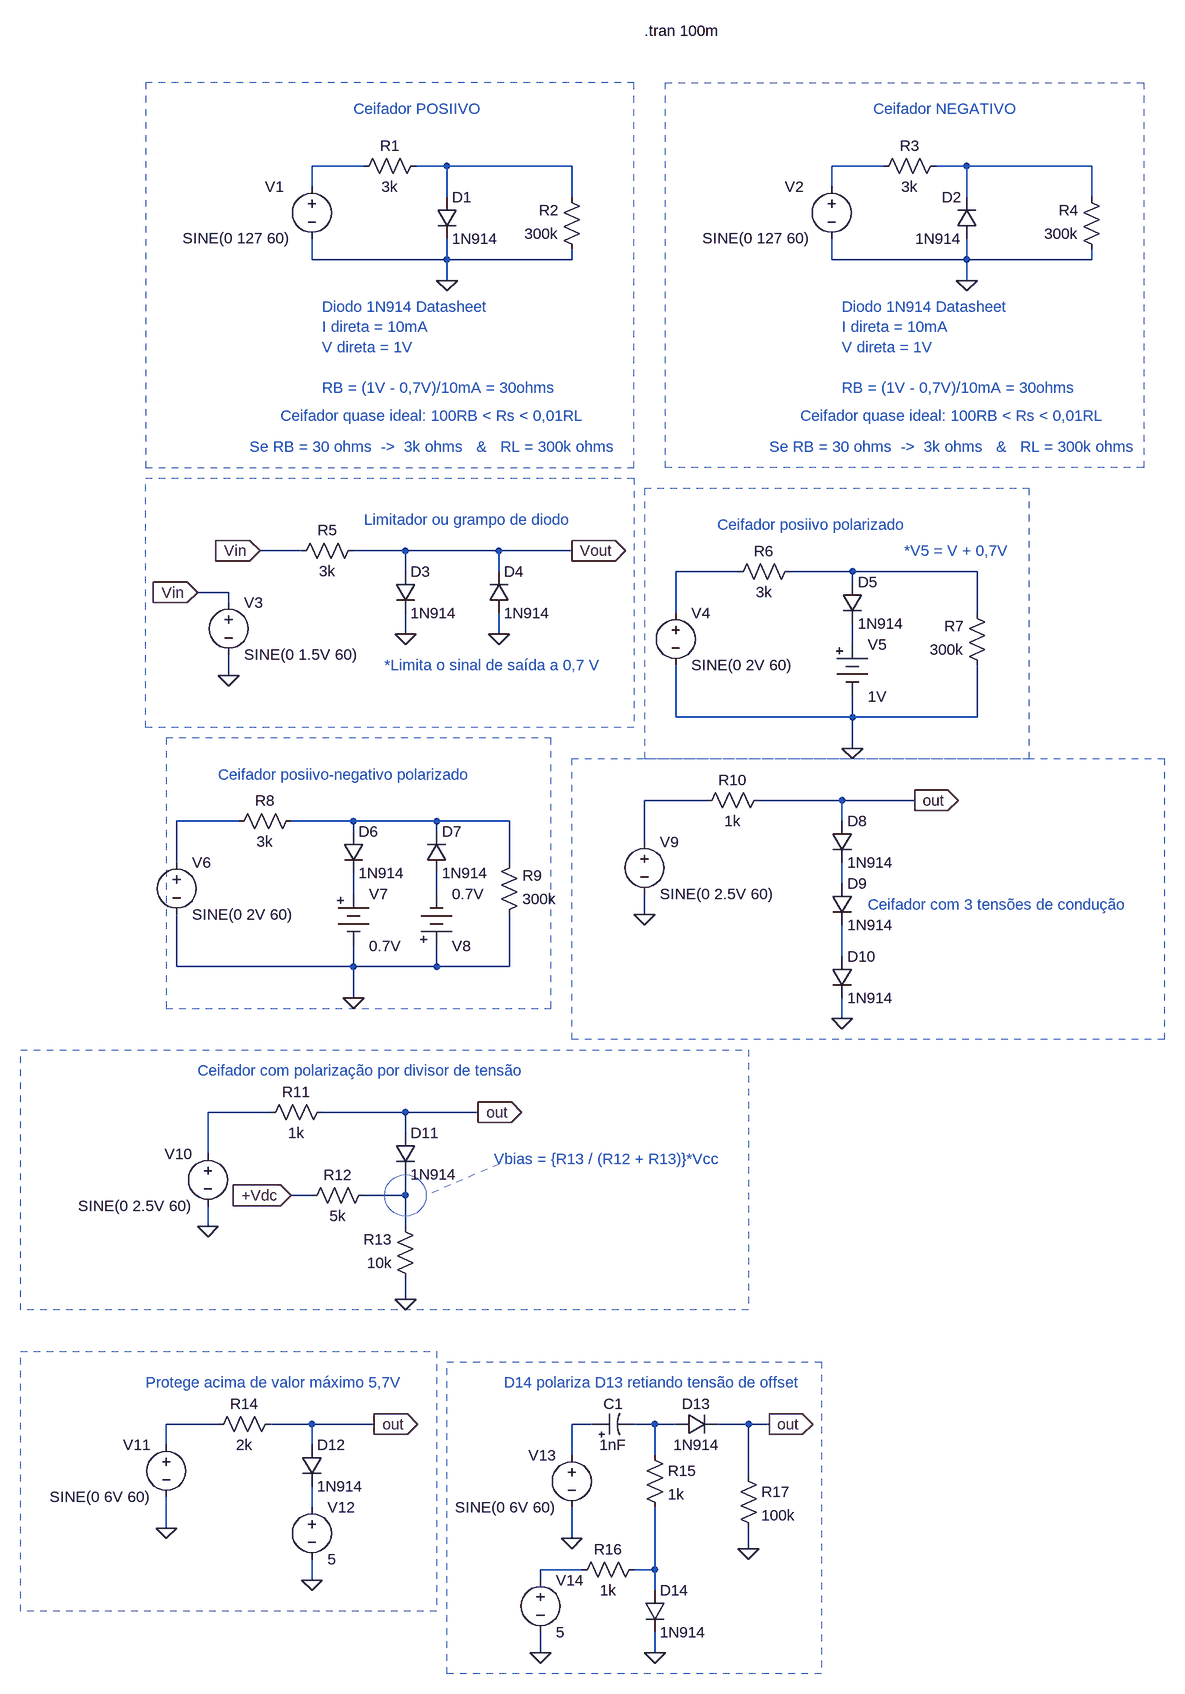
[diagram p0: schematic Circuitos ceifadores com diodos.asc]
Circuitos ceifadores com diodos.asc, the LTspice schematic file:
Version 4.1
SHEET 1 1296 2276
WIRE 16 -48 -64 -48
WIRE 144 -48 96 -48
WIRE 336 -48 144 -48
WIRE 816 -48 736 -48
WIRE 944 -48 896 -48
WIRE 1136 -48 944 -48
WIRE -64 -16 -64 -48
WIRE 736 -16 736 -48
WIRE 144 0 144 -48
WIRE 336 0 336 -48
WIRE 944 0 944 -48
WIRE 1136 0 1136 -48
WIRE -64 96 -64 64
WIRE 144 96 144 64
WIRE 144 96 -64 96
WIRE 336 96 336 80
WIRE 336 96 144 96
WIRE 736 96 736 64
WIRE 944 96 944 64
WIRE 944 96 736 96
WIRE 1136 96 1136 80
WIRE 1136 96 944 96
WIRE 144 128 144 96
WIRE 944 128 944 96
WIRE -80 544 -144 544
WIRE 80 544 0 544
WIRE 224 544 80 544
WIRE 336 544 224 544
WIRE 80 576 80 544
WIRE 224 576 224 544
WIRE 592 576 496 576
WIRE 768 576 672 576
WIRE 960 576 768 576
WIRE 768 592 768 576
WIRE -192 608 -240 608
WIRE -192 624 -192 608
WIRE 496 640 496 576
WIRE 960 640 960 576
WIRE 80 672 80 640
WIRE 224 672 224 640
WIRE 768 688 768 656
WIRE -192 736 -192 704
WIRE 496 800 496 720
WIRE 768 800 768 768
WIRE 768 800 496 800
WIRE 960 800 960 720
WIRE 960 800 768 800
WIRE 768 848 768 800
WIRE 544 928 448 928
WIRE 752 928 624 928
WIRE 864 928 752 928
WIRE -176 960 -272 960
WIRE 0 960 -96 960
WIRE 128 960 0 960
WIRE 240 960 128 960
WIRE 752 960 752 928
WIRE 0 976 0 960
WIRE 128 976 128 960
WIRE 448 992 448 928
WIRE -272 1024 -272 960
WIRE 240 1024 240 960
WIRE 752 1056 752 1024
WIRE 0 1072 0 1040
WIRE 128 1072 128 1040
WIRE 448 1104 448 1072
WIRE 752 1168 752 1120
WIRE -272 1184 -272 1104
WIRE 0 1184 0 1152
WIRE 0 1184 -272 1184
WIRE 128 1184 128 1152
WIRE 128 1184 0 1184
WIRE 240 1184 240 1104
WIRE 240 1184 128 1184
WIRE 0 1232 0 1184
WIRE 752 1264 752 1232
WIRE -128 1408 -224 1408
WIRE 80 1408 -48 1408
WIRE 192 1408 80 1408
WIRE 80 1440 80 1408
WIRE -224 1472 -224 1408
WIRE -64 1536 -96 1536
WIRE 80 1536 80 1504
WIRE 80 1536 16 1536
WIRE -224 1584 -224 1552
WIRE 80 1584 80 1536
WIRE 80 1696 80 1664
WIRE -208 1888 -288 1888
WIRE -64 1888 -128 1888
WIRE 32 1888 -64 1888
WIRE 368 1888 336 1888
WIRE 464 1888 432 1888
WIRE 496 1888 464 1888
WIRE 608 1888 560 1888
WIRE 640 1888 608 1888
WIRE -288 1920 -288 1888
WIRE -64 1920 -64 1888
WIRE 336 1936 336 1888
WIRE 464 1936 464 1888
WIRE 608 1968 608 1888
WIRE -64 2016 -64 1984
WIRE -288 2048 -288 2000
WIRE 336 2064 336 2016
WIRE 608 2080 608 2048
WIRE 352 2112 288 2112
WIRE 464 2112 464 2016
WIRE 464 2112 432 2112
WIRE -64 2128 -64 2096
WIRE 288 2128 288 2112
WIRE 464 2144 464 2112
WIRE 288 2240 288 2208
WIRE 464 2240 464 2208
FLAG 144 128 0
FLAG 944 128 0
FLAG -144 544 Vin
IOPIN -144 544 In
FLAG 80 672 0
FLAG 224 672 0
FLAG 336 544 Vout
IOPIN 336 544 Out
FLAG -240 608 Vin
IOPIN -240 608 In
FLAG -192 736 0
FLAG 768 848 0
FLAG 0 1232 0
FLAG 448 1104 0
FLAG 752 1264 0
FLAG 864 928 out
IOPIN 864 928 Out
FLAG -224 1584 0
FLAG 192 1408 out
IOPIN 192 1408 Out
FLAG 80 1696 0
FLAG -96 1536 +Vdc
IOPIN -96 1536 In
FLAG 32 1888 out
IOPIN 32 1888 Out
FLAG -64 2128 0
FLAG -288 2048 0
FLAG 336 2064 0
FLAG 464 2240 0
FLAG 608 2080 0
FLAG 640 1888 out
IOPIN 640 1888 Out
FLAG 288 2240 0
SYMBOL diode 128 0 R0
SYMATTR InstName D1
SYMATTR Value 1N914
SYMBOL res 112 -64 R90
WINDOW 0 0 56 VBottom 2
WINDOW 3 32 56 VTop 2
SYMATTR InstName R1
SYMATTR Value 3k
SYMBOL res 352 96 R180
WINDOW 0 36 76 Left 2
WINDOW 3 36 40 Left 2
SYMATTR InstName R2
SYMATTR Value 300k
SYMBOL voltage -64 -32 R0
WINDOW 0 -72 16 Left 2
WINDOW 3 -199 95 Left 2
WINDOW 123 0 0 Left 0
WINDOW 39 0 0 Left 0
SYMATTR InstName V1
SYMATTR Value SINE(0 127 60)
SYMBOL diode 960 64 R180
WINDOW 0 24 64 Left 2
WINDOW 3 24 0 Left 2
SYMATTR InstName D2
SYMATTR Value 1N914
SYMBOL res 912 -64 R90
WINDOW 0 0 56 VBottom 2
WINDOW 3 32 56 VTop 2
SYMATTR InstName R3
SYMATTR Value 3k
SYMBOL res 1152 96 R180
WINDOW 0 36 76 Left 2
WINDOW 3 36 40 Left 2
SYMATTR InstName R4
SYMATTR Value 300k
SYMBOL voltage 736 -32 R0
WINDOW 0 -72 16 Left 2
WINDOW 3 -199 95 Left 2
WINDOW 123 0 0 Left 0
WINDOW 39 0 0 Left 0
SYMATTR InstName V2
SYMATTR Value SINE(0 127 60)
SYMBOL res 16 528 R90
WINDOW 0 0 56 VBottom 2
WINDOW 3 32 56 VTop 2
SYMATTR InstName R5
SYMATTR Value 3k
SYMBOL diode 64 576 R0
SYMATTR InstName D3
SYMATTR Value 1N914
SYMBOL diode 208 640 M180
WINDOW 0 24 64 Left 2
WINDOW 3 24 0 Left 2
SYMATTR InstName D4
SYMATTR Value 1N914
SYMBOL voltage -192 608 R0
WINDOW 123 0 0 Left 0
WINDOW 39 0 0 Left 0
SYMATTR InstName V3
SYMATTR Value SINE(0 1.5V 60)
SYMBOL voltage 496 624 R0
WINDOW 123 0 0 Left 0
WINDOW 39 0 0 Left 0
SYMATTR InstName V4
SYMATTR Value SINE(0 2V 60)
SYMBOL res 688 560 R90
WINDOW 0 0 56 VBottom 2
WINDOW 3 32 56 VTop 2
SYMATTR InstName R6
SYMATTR Value 3k
SYMBOL diode 752 592 R0
SYMATTR InstName D5
SYMATTR Value 1N914
SYMBOL Misc\\battery 768 672 R0
WINDOW 123 0 0 Left 0
WINDOW 39 0 0 Left 0
SYMATTR InstName V5
SYMATTR Value 1V
SYMBOL res 976 736 R180
WINDOW 0 36 76 Left 2
WINDOW 3 36 40 Left 2
SYMATTR InstName R7
SYMATTR Value 300k
SYMBOL voltage -272 1008 R0
WINDOW 123 0 0 Left 0
WINDOW 39 0 0 Left 0
SYMATTR InstName V6
SYMATTR Value SINE(0 2V 60)
SYMBOL res -80 944 R90
WINDOW 0 0 56 VBottom 2
WINDOW 3 32 56 VTop 2
SYMATTR InstName R8
SYMATTR Value 3k
SYMBOL diode -16 976 R0
SYMATTR InstName D6
SYMATTR Value 1N914
SYMBOL Misc\\battery 0 1056 R0
WINDOW 123 0 0 Left 0
WINDOW 39 0 0 Left 0
SYMATTR InstName V7
SYMATTR Value 0.7V
SYMBOL res 224 1120 M180
WINDOW 0 36 76 Left 2
WINDOW 3 36 40 Left 2
SYMATTR InstName R9
SYMATTR Value 300k
SYMBOL diode 112 1040 M180
WINDOW 0 24 64 Left 2
WINDOW 3 24 0 Left 2
SYMATTR InstName D7
SYMATTR Value 1N914
SYMBOL Misc\\battery 128 1168 M180
WINDOW 123 0 0 Left 0
WINDOW 39 0 0 Left 0
SYMATTR InstName V8
SYMATTR Value 0.7V
SYMBOL voltage 448 976 R0
WINDOW 123 0 0 Left 0
WINDOW 39 0 0 Left 0
SYMATTR InstName V9
SYMATTR Value SINE(0 2.5V 60)
SYMBOL res 640 912 R90
WINDOW 0 0 56 VBottom 2
WINDOW 3 32 56 VTop 2
SYMATTR InstName R10
SYMATTR Value 1k
SYMBOL diode 736 960 R0
SYMATTR InstName D8
SYMATTR Value 1N914
SYMBOL diode 736 1056 R0
SYMATTR InstName D9
SYMATTR Value 1N914
SYMBOL diode 736 1168 R0
SYMATTR InstName D10
SYMATTR Value 1N914
SYMBOL voltage -224 1456 M0
WINDOW 123 0 0 Left 0
WINDOW 39 0 0 Left 0
SYMATTR InstName V10
SYMATTR Value SINE(0 2.5V 60)
SYMBOL res -32 1392 R90
WINDOW 0 0 56 VBottom 2
WINDOW 3 32 56 VTop 2
SYMATTR InstName R11
SYMATTR Value 1k
SYMBOL diode 64 1440 R0
SYMATTR InstName D11
SYMATTR Value 1N914
SYMBOL res 32 1520 R90
WINDOW 0 0 56 VBottom 2
WINDOW 3 32 56 VTop 2
SYMATTR InstName R12
SYMATTR Value 5k
SYMBOL res 96 1680 R180
WINDOW 0 36 76 Left 2
WINDOW 3 36 40 Left 2
SYMATTR InstName R13
SYMATTR Value 10k
SYMBOL voltage -288 1904 M0
WINDOW 123 0 0 Left 0
WINDOW 39 0 0 Left 0
SYMATTR InstName V11
SYMATTR Value SINE(0 6V 60)
SYMBOL res -112 1872 R90
WINDOW 0 0 56 VBottom 2
WINDOW 3 32 56 VTop 2
SYMATTR InstName R14
SYMATTR Value 2k
SYMBOL diode -80 1920 R0
SYMATTR InstName D12
SYMATTR Value 1N914
SYMBOL voltage -64 2000 R0
WINDOW 123 0 0 Left 0
WINDOW 39 0 0 Left 0
SYMATTR InstName V12
SYMATTR Value 5
SYMBOL voltage 336 1920 M0
WINDOW 123 0 0 Left 0
WINDOW 39 0 0 Left 0
SYMATTR InstName V13
SYMATTR Value SINE(0 6V 60)
SYMBOL polcap 368 1904 R270
WINDOW 0 32 32 VTop 2
WINDOW 3 0 32 VBottom 2
SYMATTR InstName C1
SYMATTR Value 1nF
SYMBOL diode 496 1904 R270
WINDOW 0 32 32 VTop 2
WINDOW 3 0 32 VBottom 2
SYMATTR InstName D13
SYMATTR Value 1N914
SYMBOL res 448 1920 R0
SYMATTR InstName R15
SYMATTR Value 1k
SYMBOL res 448 2096 R90
WINDOW 0 0 56 VBottom 2
WINDOW 3 32 56 VTop 2
SYMATTR InstName R16
SYMATTR Value 1k
SYMBOL diode 448 2144 R0
SYMATTR InstName D14
SYMATTR Value 1N914
SYMBOL res 592 1952 R0
SYMATTR InstName R17
SYMATTR Value 100k
SYMBOL voltage 288 2112 R0
WINDOW 123 0 0 Left 0
WINDOW 39 0 0 Left 0
SYMATTR InstName V14
SYMATTR Value 5
TEXT -48 168 Left 2 ;Diodo 1N914 Datasheet\nI direta = 10mA\nV direta = 1V\n \nRB = (1V - 0,7V)/10mA = 30ohms
TEXT -112 336 Left 2 ;Ceifador quase ideal: 100RB < Rs < 0,01RL
TEXT -160 384 Left 2 ;Se RB = 30 ohms  ->  3k ohms   &   RL = 300k ohms
TEXT 448 -256 Left 2 !.tran 100m
TEXT 0 -136 Left 2 ;Ceifador POSIIVO
TEXT 752 168 Left 2 ;Diodo 1N914 Datasheet\nI direta = 10mA\nV direta = 1V\n \nRB = (1V - 0,7V)/10mA = 30ohms
TEXT 688 336 Left 2 ;Ceifador quase ideal: 100RB < Rs < 0,01RL
TEXT 640 384 Left 2 ;Se RB = 30 ohms  ->  3k ohms   &   RL = 300k ohms
TEXT 800 -136 Left 2 ;Ceifador NEGATIVO
TEXT 16 496 Left 2 ;Limitador ou grampo de diodo
TEXT 48 720 Left 2 ;*Limita o sinal de saída a 0,7 V
TEXT 560 504 Left 2 ;Ceifador posiivo polarizado
TEXT 848 544 Left 2 ;*V5 = V + 0,7V
TEXT -208 888 Left 2 ;Ceifador posiivo-negativo polarizado
TEXT 792 1088 Left 2 ;Ceifador com 3 tensões de condução
TEXT -240 1344 Left 2 ;Ceifador com polarização por divisor de tensão
TEXT 216 1480 Left 2 ;Vbias = {R13 / (R12 + R13)}*Vcc
TEXT -320 1824 Left 2 ;Protege acima de valor máximo 5,7V
TEXT 232 1824 Left 2 ;D14 polariza D13 retiando tensão de offset
LINE Normal 224 1488 112 1536 2
RECTANGLE Normal 432 -176 -320 416 2
RECTANGLE Normal 1216 416 480 -176 2
RECTANGLE Normal 432 816 -320 432 2
RECTANGLE Normal 1040 448 448 864 2
RECTANGLE Normal 304 832 -288 1248 2
RECTANGLE Normal 1248 1296 336 864 2
RECTANGLE Normal 608 1712 -512 1312 2
RECTANGLE Normal 128 2176 -512 1776 2
RECTANGLE Normal 720 2272 144 1792 2
CIRCLE Normal 48 1504 112 1568 2

The netlist it stands for:
* Circuitos ceifadores com diodos.asc
D1 N002 0 1N914
R1 N002 N001 3k
R2 0 N002 300k
V1 N001 0 SINE(0 127 60)
D2 0 N004 1N914
R3 N004 N003 3k
R4 0 N004 300k
V2 N003 0 SINE(0 127 60)
R5 Vout Vin 3k
D3 Vout 0 1N914
D4 0 Vout 1N914
V3 Vin 0 SINE(0 1.5V 60)
V4 N005 0 SINE(0 2V 60)
R6 N006 N005 3k
D5 N006 N007 1N914
V5 N007 0 1V
R7 0 N006 300k
V6 N009 0 SINE(0 2V 60)
R8 N010 N009 3k
D6 N010 N012 1N914
V7 N012 0 0.7V
R9 0 N010 300k
D7 N013 N010 1N914
V8 0 N013 0.7V
V9 N008 0 SINE(0 2.5V 60)
R10 out N008 1k
D8 out N011 1N914
D9 N011 N014 1N914
D10 N014 0 1N914
V10 N015 0 SINE(0 2.5V 60)
R11 out N015 1k
D11 out N016 1N914
R12 N016 +Vdc 5k
R13 0 N016 10k
V11 N017 0 SINE(0 6V 60)
R14 out N017 2k
D12 out N020 1N914
V12 N020 0 5
V13 N018 0 SINE(0 6V 60)
C1 N018 N019 1nF
D13 N019 out 1N914
R15 N019 N022 1k
R16 N022 N021 1k
D14 N022 0 1N914
R17 out 0 100k
V14 N021 0 5
.model D D
.lib standard.dio
* Diodo 1N914 Datasheet
* I direta = 10mA
* V direta = 1V
* RB = (1V - 0,7V)/10mA = 30ohms
* Ceifador quase ideal: 100RB < Rs < 0,01RL
* Se RB = 30 ohms  ->  3k ohms   &   RL = 300k ohms
.tran 100m
* Ceifador POSIIVO
* Diodo 1N914 Datasheet
* I direta = 10mA
* V direta = 1V
* RB = (1V - 0,7V)/10mA = 30ohms
* Ceifador quase ideal: 100RB < Rs < 0,01RL
* Se RB = 30 ohms  ->  3k ohms   &   RL = 300k ohms
* Ceifador NEGATIVO
* Limitador ou grampo de diodo
* *Limita o sinal de saída a 0,7 V
* Ceifador posiivo polarizado
* *V5 = V + 0,7V
* Ceifador posiivo-negativo polarizado
* Ceifador com 3 tensões de condução
* Ceifador com polarização por divisor de tensão
* Vbias = {R13 / (R12 + R13)}*Vcc
* Protege acima de valor máximo 5,7V
* D14 polariza D13 retiando tensão de offset
.backanno
.end